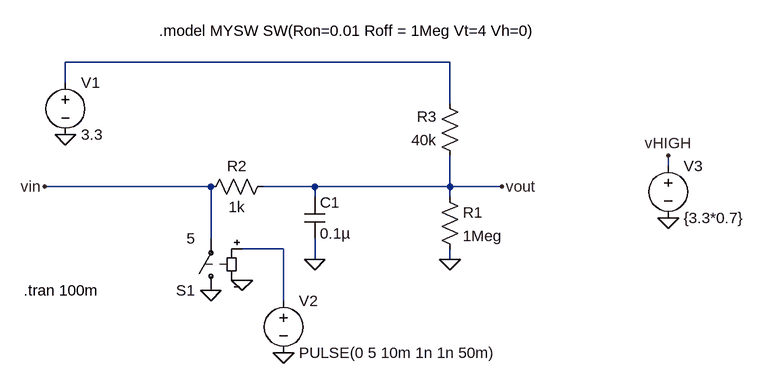
[diagram p0: schematic Draft1.asc]
Draft1.asc, the LTspice schematic file:
Version 4
SHEET 1 880 680
WIRE 288 -48 -304 -48
WIRE -304 -16 -304 -48
WIRE 288 16 288 -48
WIRE 624 112 624 96
WIRE -80 144 -336 144
WIRE 80 144 0 144
WIRE 288 144 288 96
WIRE 288 144 80 144
WIRE 368 144 288 144
WIRE 80 160 80 144
WIRE 288 160 288 144
WIRE -80 224 -80 144
WIRE 32 240 -32 240
WIRE 80 256 80 224
WIRE 288 256 288 240
WIRE 32 320 32 240
FLAG 80 256 0
FLAG 288 256 0
FLAG -304 64 0
FLAG -80 304 0
FLAG -32 288 0
FLAG 32 400 0
FLAG -336 144 vin
FLAG 368 144 vout
FLAG 624 192 0
FLAG 624 96 vHIGH
SYMBOL res 272 144 R0
SYMATTR InstName R1
SYMATTR Value 1Meg
SYMBOL res 16 128 R90
WINDOW 0 0 56 VBottom 2
WINDOW 3 32 56 VTop 2
SYMATTR InstName R2
SYMATTR Value 1k
SYMBOL res 304 112 R180
WINDOW 0 36 76 Left 2
WINDOW 3 36 40 Left 2
SYMATTR InstName R3
SYMATTR Value 40k
SYMBOL cap 64 160 R0
SYMATTR InstName C1
SYMATTR Value 0.1µ
SYMBOL voltage -304 -32 R0
WINDOW 123 0 0 Left 0
WINDOW 39 0 0 Left 0
SYMATTR InstName V1
SYMATTR Value 3.3
SYMBOL sw -80 320 R180
SYMATTR InstName S1
SYMATTR Value 5
SYMATTR Prefix SW
SYMATTR SpiceModel MYSW
SYMBOL voltage 32 304 R0
WINDOW 123 0 0 Left 0
WINDOW 39 0 0 Left 0
SYMATTR InstName V2
SYMATTR Value PULSE(0 5 10m 1n 1n 50m)
SYMBOL voltage 624 96 R0
WINDOW 123 0 0 Left 0
WINDOW 39 0 0 Left 0
SYMATTR InstName V3
SYMATTR Value {3.3*0.7}
TEXT -160 -96 Left 2 !.model MYSW SW(Ron=0.01 Roff = 1Meg Vt=4 Vh=0)
TEXT -368 304 Left 2 !.tran 100m

The netlist it stands for:
* Draft1.asc
R1 vout 0 1Meg
R2 vout vin 1k
R3 vout N001 40k
C1 vout 0 0.1µ
V1 N001 0 3.3
S1 0 vin N002 0 MYSW 5
V2 N002 0 PULSE(0 5 10m 1n 1n 50m)
V3 vHIGH 0 {3.3*0.7}
.model MYSW SW(Ron=0.01 Roff = 1Meg Vt=4 Vh=0)
.tran 100m
.backanno
.end

* Results of the author's LTspice run, read from the files saved beside the schematic
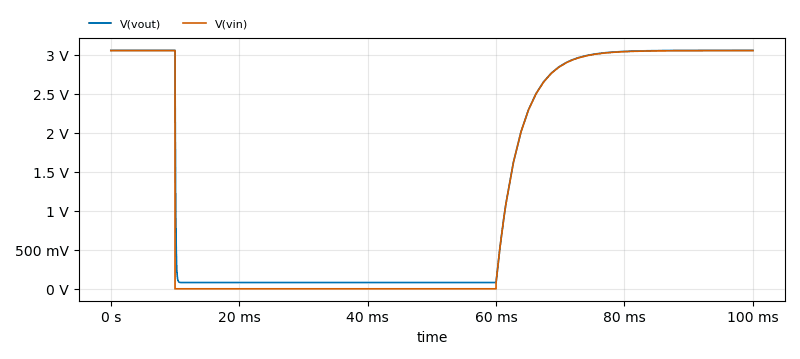
[diagram p1: Transient Analysis of Draft1.asc, plotted from the saved traces]
* Transient Analysis, 1 run:
*   V(vout): min 80.41 mV, max 3.056 V, average 1.46 V, rms 2.041 V, last 3.056 V
*   V(vin): min 804.1 nV, max 3.053 V, average 1.416 V, rms 2.037 V, last 3.053 V